# EAGLE design BMS_Slave (EAGLE 7.2.0)

## Sheet 1 of 3
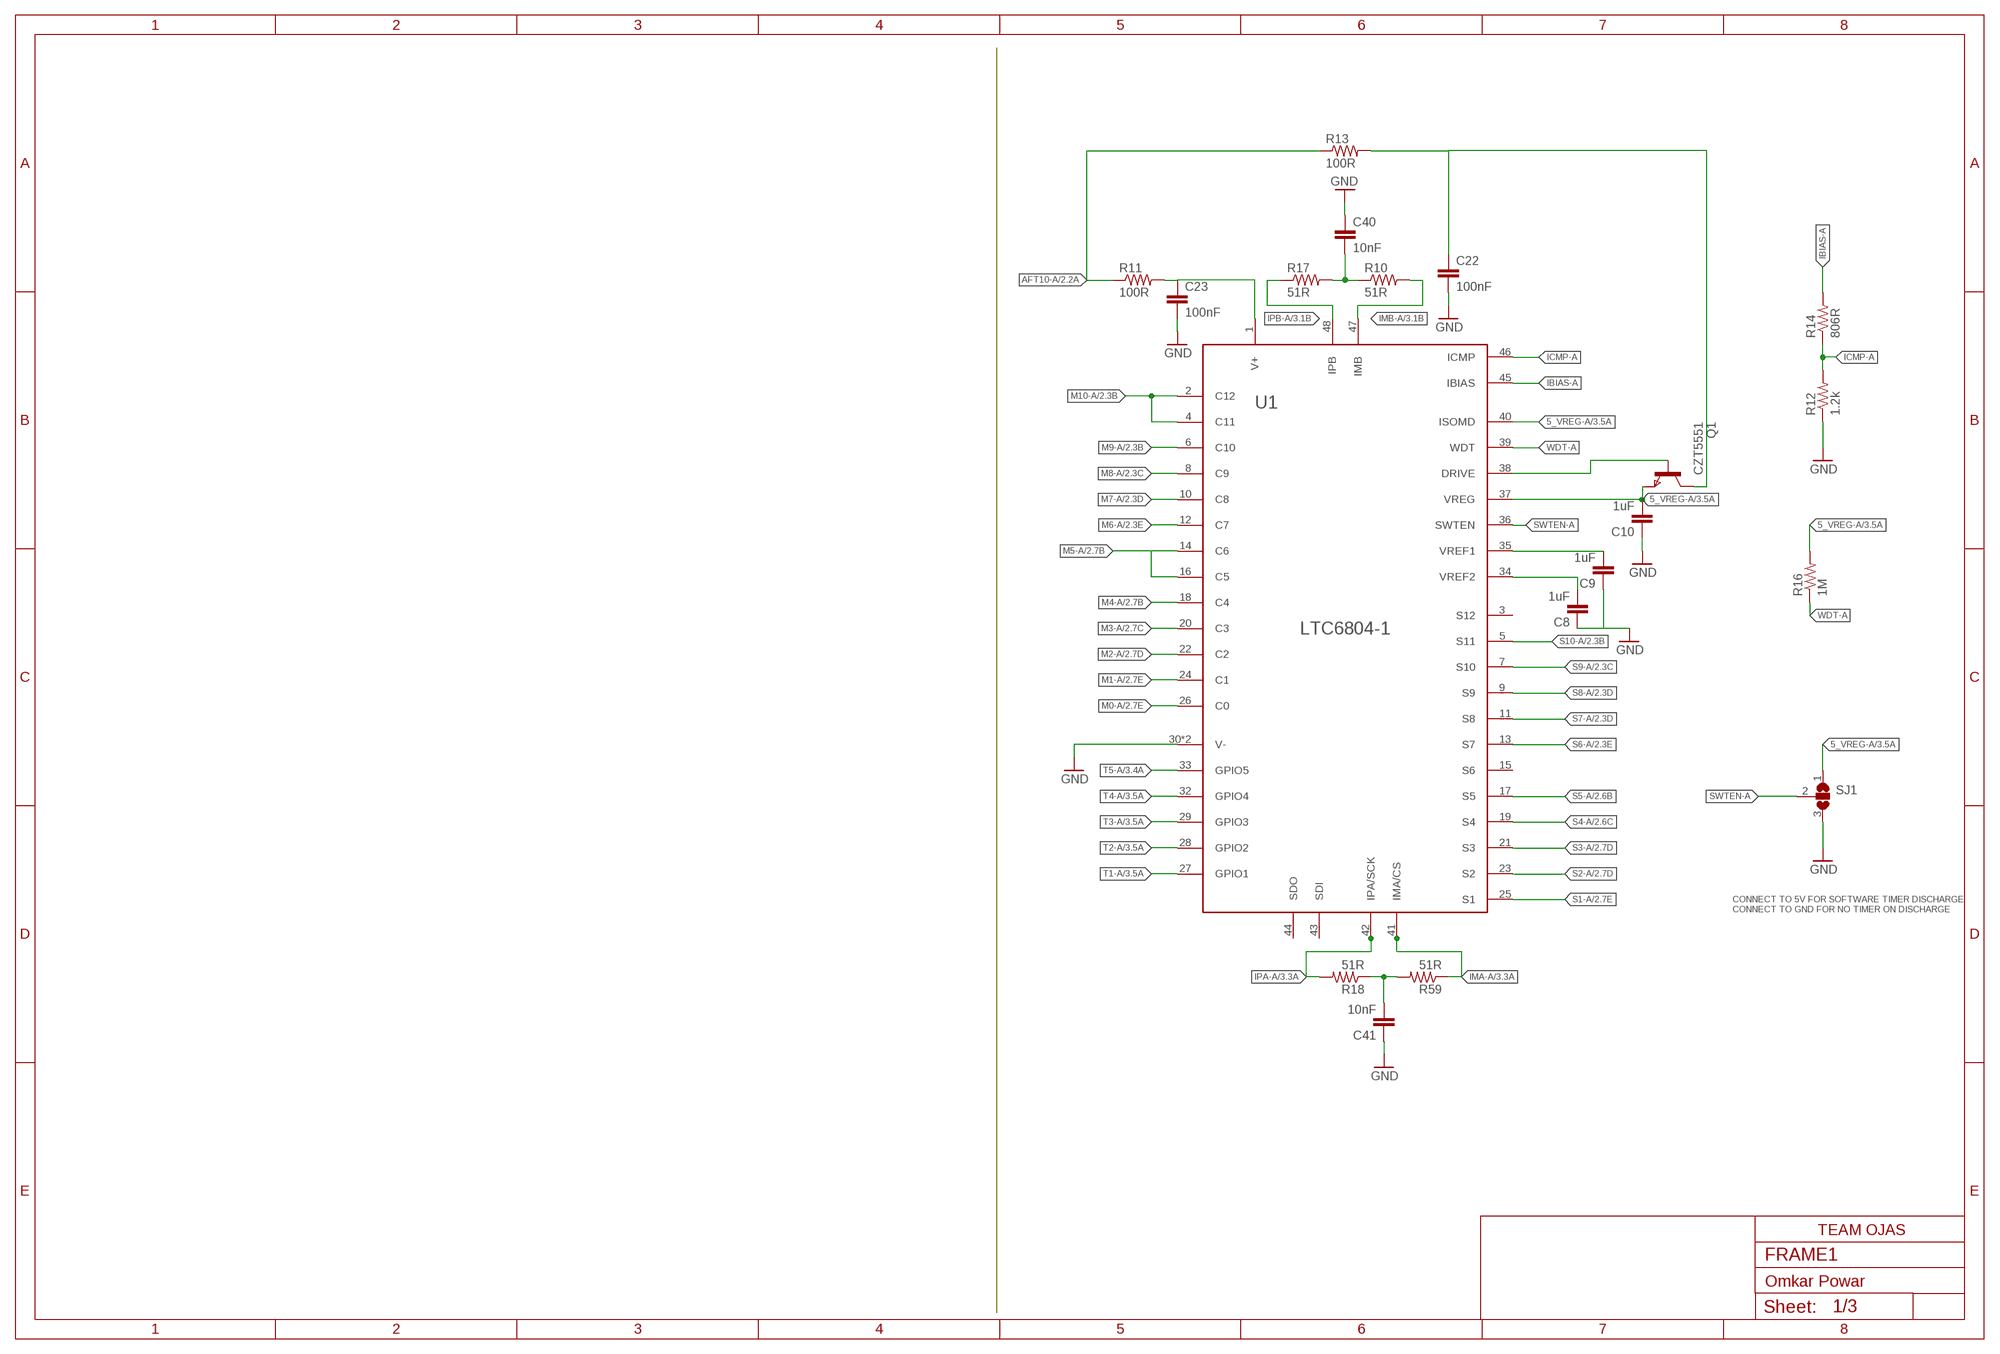
[diagram p0: schematic, sheet 1]

### Parts
C8  1uF  C0603  [0603]
C9  1uF  C0603  [0603]
C10  1uF  C0603  [0603]
C22  100nF  C0805  [0805]
C23  100nF  C0805  [0805]
C40  10nF  C0805  [0805]
C41  10nF  C0805  [0805]
Q1  CZT5551  NSV1C201MZ4  [SOT223]
R10  51R  R0603  [0603]
R11  100R  R0603  [0603]
R12  1.2k  R0603  [0603]
R13  100R  R0603  [0603]
R14  806R  R0603  [0603]
R16  1M  R0603  [0603]
R17  51R  R0603  [0603]
R18  51R  R0603  [0603]
R59  51R  R0603  [0603]
SJ1  SJ2W  [SJ_2]
U1  LTC6804  [48-LEAD_SSOP]

### Nets
5_VREG-A: C10.P$2 Q1.3(E) R16.P$2 SJ1.1 U1.37(VREG) U1.40(ISOMD) ; also sheet 3
AFT10-A: R11.P$1 R13.P$1 ; also sheet 2
GNDA: C8.P$1 C9.P$1 C10.P$1 C22.P$2 C23.P$2 C40.P$1 C41.P$1 R12.P$1 SJ1.3 U1.30(V-) U1.31(V-) ; supply symbol labelled GND ; also sheet 2,3
IBIAS-A: R14.P$2 U1.45(IBIAS)
ICMP-A: R12.P$2 R14.P$1 U1.46(ICMP)
IMA-A: R59.P$1 U1.41(IMA/CS) ; also sheet 3
IMB-A: R10.P$2 U1.47(IMB) ; also sheet 3
IPA-A: R18.P$2 U1.42(IPA/SCK) ; also sheet 3
IPB-A: R17.P$1 U1.48(IPB) ; also sheet 3
M0-A: U1.26(C0) ; also sheet 2
M1-A: U1.24(C1) ; also sheet 2
M2-A: U1.22(C2) ; also sheet 2
M3-A: U1.20(C3) ; also sheet 2
M4-A: U1.18(C4) ; also sheet 2
M5-A: U1.14(C6) U1.16(C5) ; also sheet 2
M6-A: U1.12(C7) ; also sheet 2
M7-A: U1.10(C8) ; also sheet 2
M8-A: U1.8(C9) ; also sheet 2
M9-A: U1.6(C10) ; also sheet 2
M10-A: U1.2(C12) U1.4(C11) ; also sheet 2
N$2: C9.P$2 U1.35(VREF1)
N$3: C8.P$2 U1.34(VREF2)
N$18: C40.P$2 R10.P$1 R17.P$2
N$20: C41.P$2 R18.P$1 R59.P$2
N$36: Q1.1(B) U1.38(DRIVE)
N$49: C22.P$1 Q1.2(C) Q1.4(C) R13.P$2
N$66: C23.P$1 R11.P$2 U1.1(V+)
S1-A: U1.25(S1) ; also sheet 2
S2-A: U1.23(S2) ; also sheet 2
S3-A: U1.21(S3) ; also sheet 2
S4-A: U1.19(S4) ; also sheet 2
S5-A: U1.17(S5) ; also sheet 2
S6-A: U1.13(S7) ; also sheet 2
S7-A: U1.11(S8) ; also sheet 2
S8-A: U1.9(S9) ; also sheet 2
S9-A: U1.7(S10) ; also sheet 2
S10-A: U1.5(S11) ; also sheet 2
SWTEN-A: SJ1.2 U1.36(SWTEN)
T1-A: U1.27(GPIO1) ; also sheet 3
T2-A: U1.28(GPIO2) ; also sheet 3
T3-A: U1.29(GPIO3) ; also sheet 3
T4-A: U1.32(GPIO4) ; also sheet 3
T5-A: U1.33(GPIO5) ; also sheet 3
WDT-A: R16.P$1 U1.39(WDT)
Unconnected: U1.3(S12) U1.15(S6) U1.43(SDI) U1.44(SDO)

### Notes on the sheet
- CONNECT TO 5V FOR SOFTWARE TIMER DISCHARGE
  CONNECT TO GND FOR NO TIMER ON DISCHARGE

## Sheet 2 of 3
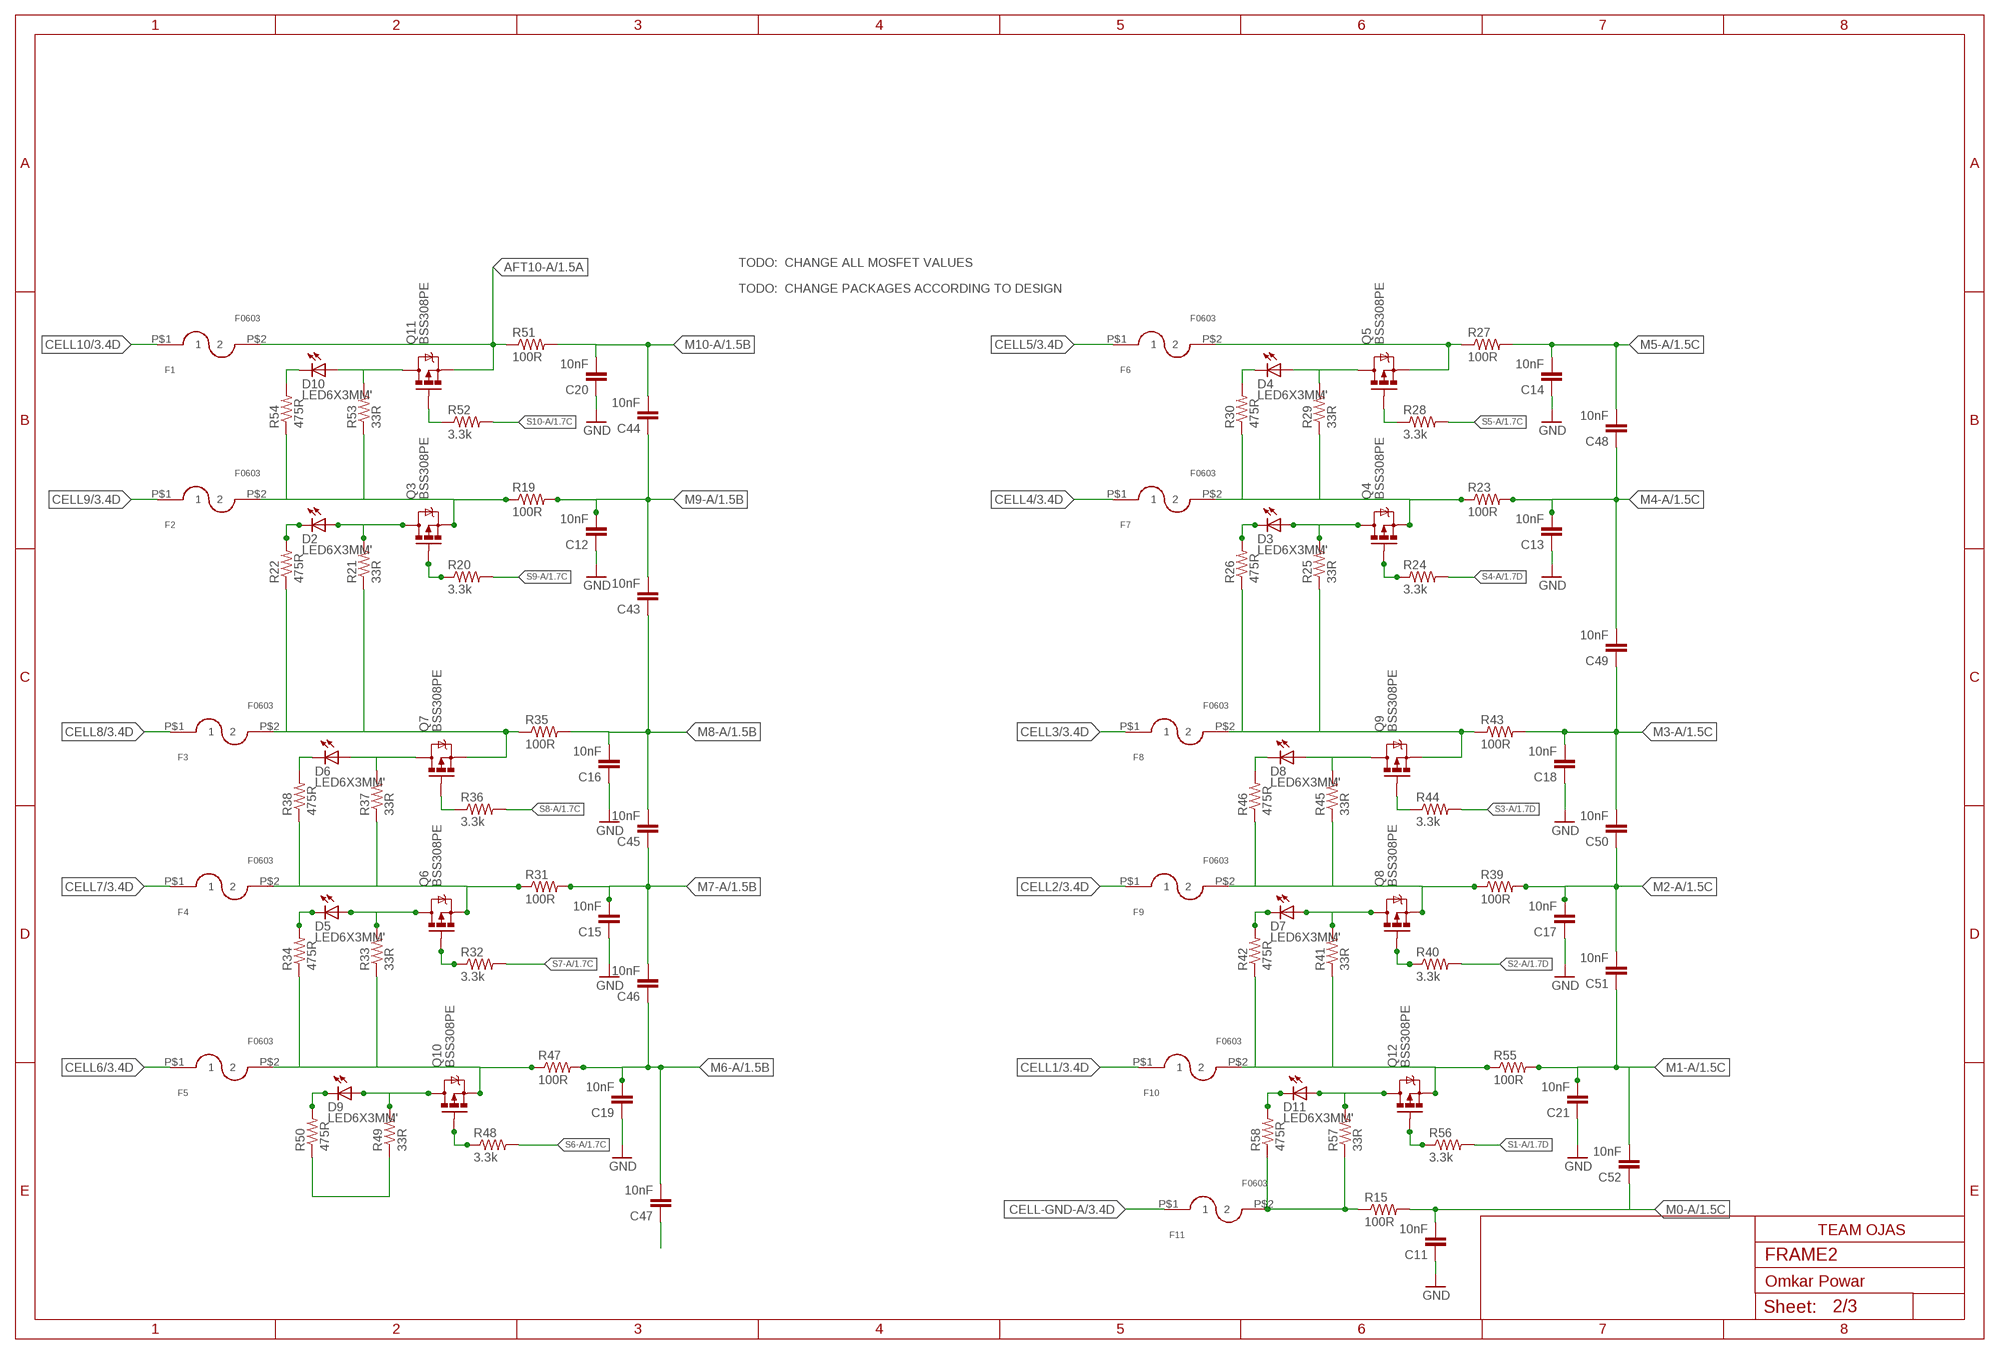
[diagram p1: schematic, sheet 2]

### Parts
C11  10nF  C0603  [0603]
C12  10nF  C0603  [0603]
C13  10nF  C0603  [0603]
C14  10nF  C0603  [0603]
C15  10nF  C0603  [0603]
C16  10nF  C0603  [0603]
C17  10nF  C0603  [0603]
C18  10nF  C0603  [0603]
C19  10nF  C0603  [0603]
C20  10nF  C0603  [0603]
C21  10nF  C0603  [0603]
C43  10nF  C0603  [0603]
C44  10nF  C0603  [0603]
C45  10nF  C0603  [0603]
C46  10nF  C0603  [0603]
C47  10nF  C0603  [0603]
C48  10nF  C0603  [0603]
C49  10nF  C0603  [0603]
C50  10nF  C0603  [0603]
C51  10nF  C0603  [0603]
C52  10nF  C0603  [0603]
D2  LED6X3MM'  [LED0603]
D3  LED6X3MM'  [LED0603]
D4  LED6X3MM'  [LED0603]
D5  LED6X3MM'  [LED0603]
D6  LED6X3MM'  [LED0603]
D7  LED6X3MM'  [LED0603]
D8  LED6X3MM'  [LED0603]
D9  LED6X3MM'  [LED0603]
D10  LED6X3MM'  [LED0603]
D11  LED6X3MM'  [LED0603]
F1  F0603  [0603]
F2  F0603  [0603]
F3  F0603  [0603]
F4  F0603  [0603]
F5  F0603  [0603]
F6  F0603  [0603]
F7  F0603  [0603]
F8  F0603  [0603]
F9  F0603  [0603]
F10  F0603  [0603]
F11  F0603  [0603]
Q3  BSS308PE  MOSFET-P_CHANNEL  [SOT23-3]
Q4  BSS308PE  MOSFET-P_CHANNEL  [SOT23-3]
Q5  BSS308PE  MOSFET-P_CHANNEL  [SOT23-3]
Q6  BSS308PE  MOSFET-P_CHANNEL  [SOT23-3]
Q7  BSS308PE  MOSFET-P_CHANNEL  [SOT23-3]
Q8  BSS308PE  MOSFET-P_CHANNEL  [SOT23-3]
Q9  BSS308PE  MOSFET-P_CHANNEL  [SOT23-3]
Q10  BSS308PE  MOSFET-P_CHANNEL  [SOT23-3]
Q11  BSS308PE  MOSFET-P_CHANNEL  [SOT23-3]
Q12  BSS308PE  MOSFET-P_CHANNEL  [SOT23-3]
R15  100R  R0603  [0603]
R19  100R  R0603  [0603]
R20  3.3k  R0603  [0603]
R21  33R  R2512  [2512]
R22  475R  R0603  [0603]
R23  100R  R0603  [0603]
R24  3.3k  R0603  [0603]
R25  33R  R2512  [2512]
R26  475R  R0603  [0603]
R27  100R  R0603  [0603]
R28  3.3k  R0603  [0603]
R29  33R  R2512  [2512]
R30  475R  R0603  [0603]
R31  100R  R0603  [0603]
R32  3.3k  R0603  [0603]
R33  33R  R2512  [2512]
R34  475R  R0603  [0603]
R35  100R  R0603  [0603]
R36  3.3k  R0603  [0603]
R37  33R  R2512  [2512]
R38  475R  R0603  [0603]
R39  100R  R0603  [0603]
R40  3.3k  R0603  [0603]
R41  33R  R2512  [2512]
R42  475R  R0603  [0603]
R43  100R  R0603  [0603]
R44  3.3k  R0603  [0603]
R45  33R  R2512  [2512]
R46  475R  R0603  [0603]
R47  100R  R0603  [0603]
R48  3.3k  R0603  [0603]
R49  33R  R2512  [2512]
R50  475R  R0603  [0603]
R51  100R  R0603  [0603]
R52  3.3k  R0603  [0603]
R53  33R  R2512  [2512]
R54  475R  R0603  [0603]
R55  100R  R0603  [0603]
R56  3.3k  R0603  [0603]
R57  33R  R2512  [2512]
R58  475R  R0603  [0603]

### Nets
AFT0: F11.P$2 R15.P$1 R57.1 R58.P$1
AFT1: F10.P$2 Q12.2(S) R41.1 R42.P$1 R55.P$1
AFT2: F9.P$2 Q8.2(S) R39.P$1 R45.1 R46.P$1
AFT3: F8.P$2 Q9.2(S) R25.1 R26.P$1 R43.P$1
AFT4: F7.P$2 Q4.2(S) R23.P$1 R29.1 R30.P$1
AFT5: F6.P$2 Q5.2(S) R27.P$1 R49.1 R50.P$1
AFT6: F5.P$2 Q10.2(S) R33.1 R34.P$1 R47.P$1
AFT7: F4.P$2 Q6.2(S) R31.P$1 R37.1 R38.P$1
AFT8: F3.P$2 Q7.2(S) R21.1 R22.P$1 R35.P$1
AFT9: F2.P$2 Q3.2(S) R19.P$1 R53.1 R54.P$1
AFT10-A: F1.P$2 Q11.2(S) R51.P$1 ; also sheet 1
CELL1: F10.P$1 ; also sheet 3
CELL2: F9.P$1 ; also sheet 3
CELL3: F8.P$1 ; also sheet 3
CELL4: F7.P$1 ; also sheet 3
CELL5: F6.P$1 ; also sheet 3
CELL6: F5.P$1 ; also sheet 3
CELL7: F4.P$1 ; also sheet 3
CELL8: F3.P$1 ; also sheet 3
CELL9: F2.P$1 ; also sheet 3
CELL10: F1.P$1 ; also sheet 3
CELL-GND-A: F11.P$1 ; also sheet 3
GNDA: C11.P$1 C12.P$1 C13.P$1 C14.P$1 C15.P$1 C16.P$1 C17.P$1 C18.P$1 C19.P$1 C20.P$1 C21.P$1 ; supply symbol labelled GND ; also sheet 1,3
M0-A: C11.P$2 C52.P$1 R15.P$2 ; also sheet 1
M1-A: C21.P$2 C51.P$1 C52.P$2 R55.P$2 ; also sheet 1
M2-A: C17.P$2 C50.P$1 C51.P$2 R39.P$2 ; also sheet 1
M3-A: C18.P$2 C49.P$1 C50.P$2 R43.P$2 ; also sheet 1
M4-A: C13.P$2 C48.P$1 C49.P$2 R23.P$2 ; also sheet 1
M5-A: C14.P$2 C47.P$1 C48.P$2 R27.P$2 ; also sheet 1
M6-A: C19.P$2 C46.P$1 C47.P$2 R47.P$2 ; also sheet 1
M7-A: C15.P$2 C45.P$1 C46.P$2 R31.P$2 ; also sheet 1
M8-A: C16.P$2 C43.P$1 C45.P$2 R35.P$2 ; also sheet 1
M9-A: C12.P$2 C43.P$2 C44.P$1 R19.P$2 ; also sheet 1
M10-A: C20.P$2 C44.P$2 R51.P$2 ; also sheet 1
N$70: D2.P$1(A) Q3.3(D) R21.2
N$71: D2.P$2(C) R22.P$2
N$72: Q3.1(G) R20.P$1
N$75: D3.P$1(A) Q4.3(D) R25.2
N$76: D3.P$2(C) R26.P$2
N$77: Q4.1(G) R24.P$1
N$80: D4.P$1(A) Q5.3(D) R29.2
N$81: D4.P$2(C) R30.P$2
N$82: Q5.1(G) R28.P$1
N$212: D5.P$1(A) Q6.3(D) R33.2
N$213: D5.P$2(C) R34.P$2
N$214: Q6.1(G) R32.P$1
N$217: D6.P$1(A) Q7.3(D) R37.2
N$218: D6.P$2(C) R38.P$2
N$219: Q7.1(G) R36.P$1
N$223: D7.P$1(A) Q8.3(D) R41.2
N$224: D7.P$2(C) R42.P$2
N$225: Q8.1(G) R40.P$1
N$228: D8.P$1(A) Q9.3(D) R45.2
N$229: D8.P$2(C) R46.P$2
N$230: Q9.1(G) R44.P$1
N$236: D10.P$1(A) Q11.3(D) R53.2
N$237: D10.P$2(C) R54.P$2
N$238: Q11.1(G) R52.P$1
N$239: D9.P$1(A) Q10.3(D) R49.2
N$240: D9.P$2(C) R50.P$2
N$241: Q10.1(G) R48.P$1
N$245: D11.P$1(A) Q12.3(D) R57.2
N$246: D11.P$2(C) R58.P$2
N$247: Q12.1(G) R56.P$1
S1-A: R56.P$2 ; also sheet 1
S2-A: R40.P$2 ; also sheet 1
S3-A: R44.P$2 ; also sheet 1
S4-A: R24.P$2 ; also sheet 1
S5-A: R28.P$2 ; also sheet 1
S6-A: R48.P$2 ; also sheet 1
S7-A: R32.P$2 ; also sheet 1
S8-A: R36.P$2 ; also sheet 1
S9-A: R20.P$2 ; also sheet 1
S10-A: R52.P$2 ; also sheet 1

### Notes on the sheet
- TODO:  CHANGE ALL MOSFET VALUES
- TODO:  CHANGE PACKAGES ACCORDING TO DESIGN

## Sheet 3 of 3
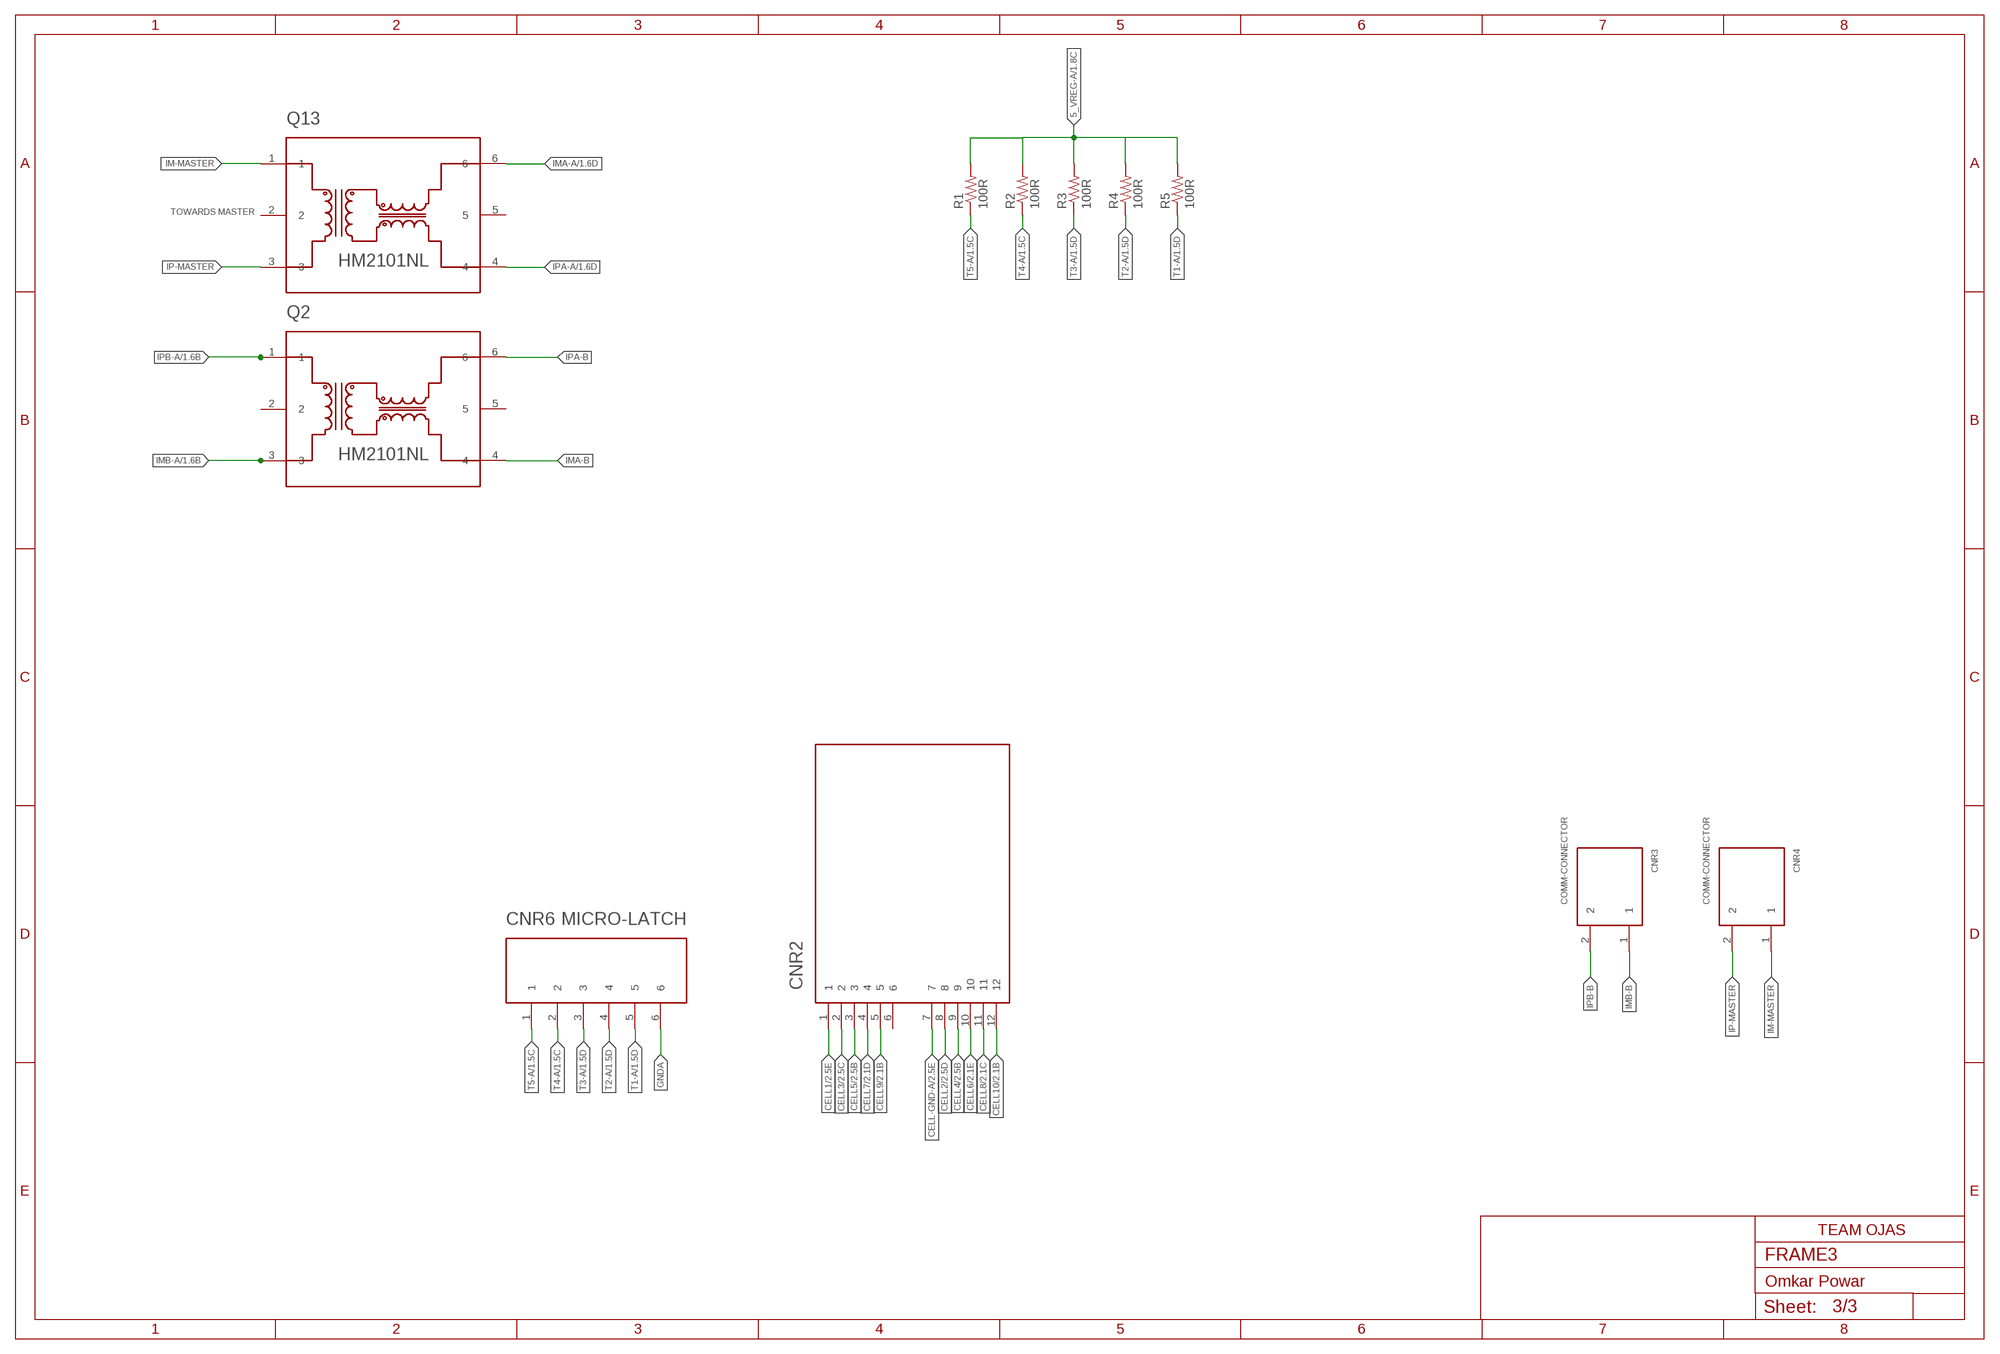
[diagram p2: schematic, sheet 3]

### Parts
CNR2  CELL-CONNECTORMOLEX-MICROFIT  [0430451200]
CNR3  COMM-CONNECTOR  [105313-2202]
CNR4  COMM-CONNECTOR  [105313-2202]
CNR6  MICRO-LATCH  TEMP-6-CONNECTORMICRO-LATCH  [0532530670]
Q2  HM2101NL  [HM2101NL]
Q13  HM2101NL  [HM2101NL]
R1  100R  R0603  [0603]
R2  100R  R0603  [0603]
R3  100R  R0603  [0603]
R4  100R  R0603  [0603]
R5  100R  R0603  [0603]

### Nets
5_VREG-A: R1.P$2 R2.P$2 R3.P$2 R4.P$2 R5.P$2 ; also sheet 1
CELL1: CNR2.1 ; also sheet 2
CELL2: CNR2.8 ; also sheet 2
CELL3: CNR2.2 ; also sheet 2
CELL4: CNR2.9 ; also sheet 2
CELL5: CNR2.3 ; also sheet 2
CELL6: CNR2.10 ; also sheet 2
CELL7: CNR2.4 ; also sheet 2
CELL8: CNR2.11 ; also sheet 2
CELL9: CNR2.5 ; also sheet 2
CELL10: CNR2.12 ; also sheet 2
CELL-GND-A: CNR2.7 ; also sheet 2
GNDA: CNR6.6 ; also sheet 1,2
IM-MASTER: CNR4.1 Q13.1
IMA-A: Q13.6 ; also sheet 1
IMA-B: Q2.4
IMB-A: Q2.3 ; also sheet 1
IMB-B: CNR3.1
IP-MASTER: CNR4.2 Q13.3
IPA-A: Q13.4 ; also sheet 1
IPA-B: Q2.6
IPB-A: Q2.1 ; also sheet 1
IPB-B: CNR3.2
T1-A: CNR6.5 R5.P$1 ; also sheet 1
T2-A: CNR6.4 R4.P$1 ; also sheet 1
T3-A: CNR6.3 R3.P$1 ; also sheet 1
T4-A: CNR6.2 R2.P$1 ; also sheet 1
T5-A: CNR6.1 R1.P$1 ; also sheet 1
Unconnected: CNR2.6 Q2.2 Q2.5 Q13.2 Q13.5

### Notes on the sheet
- TOWARDS MASTER

## Library data of the parts
C8-C23 C40 C41 C43-C52 = Team_Ojas_OVPowar:C
CNR2 = Team_Ojas_OVPowar:CELL-CONNECTOR: BMS Cell Harness Connector, TH/.025 Connector System 1318772-2,
CNR3 CNR4 = Team_Ojas_OVPowar:COMM-CONNECTOR: BMS Communication Harness Connector NanoFit RA Hdr TH DR 12Ckt 0.38um Au Ntl
CNR6 = Team_Ojas_OVPowar:TEMP-6-CONNECTOR
D2-D11 = Team_Ojas_OVPowar:LED
F1-F11 = Team_Ojas_OVPowar:F: FUSE SMD TYPE
Q1 = Team_Ojas_OVPowar:NSV1C201MZ4: NPN TRANSISTOR
Q2 Q13 = Team_Ojas_OVPowar:HM2101NL: Pulse Electronics Signal Transformers MDL SIN XFMR-CMC
Q3-Q12 = Team_Ojas_OVPowar:MOSFET-P_CHANNEL
R1-R5 R10-R59 = Team_Ojas_OVPowar:R
SJ1 = jumper:SJ2W: SMD solder JUMPER
U1 = Team_Ojas_OVPowar:LTC6804: Multicell Battery Monitors

## Board
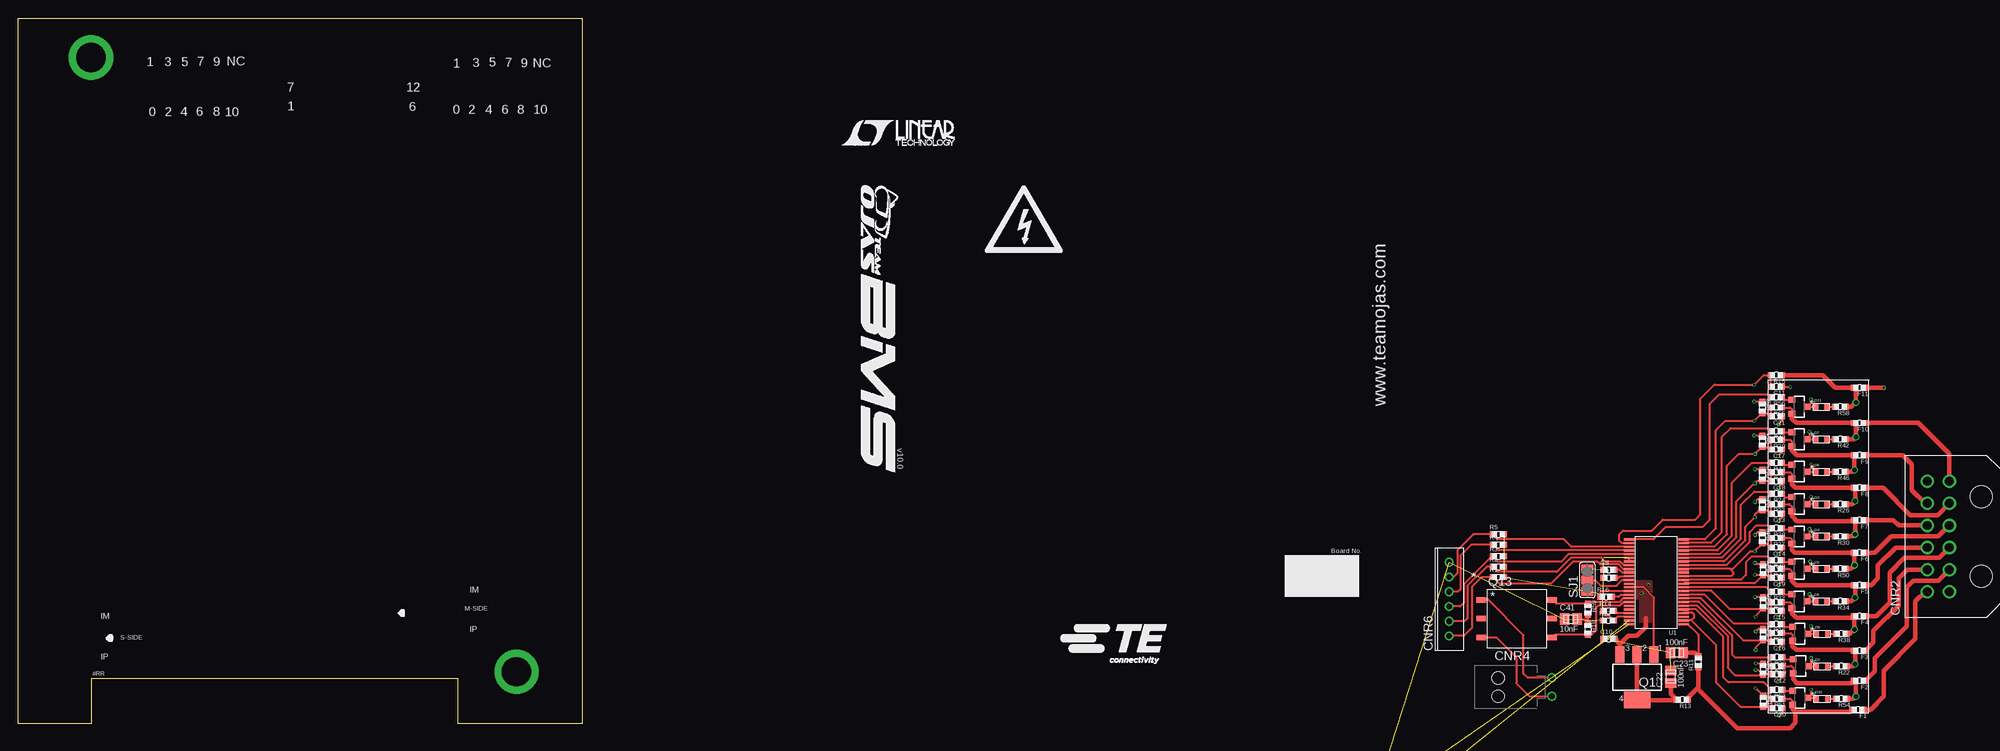
[diagram p3: board, top side]
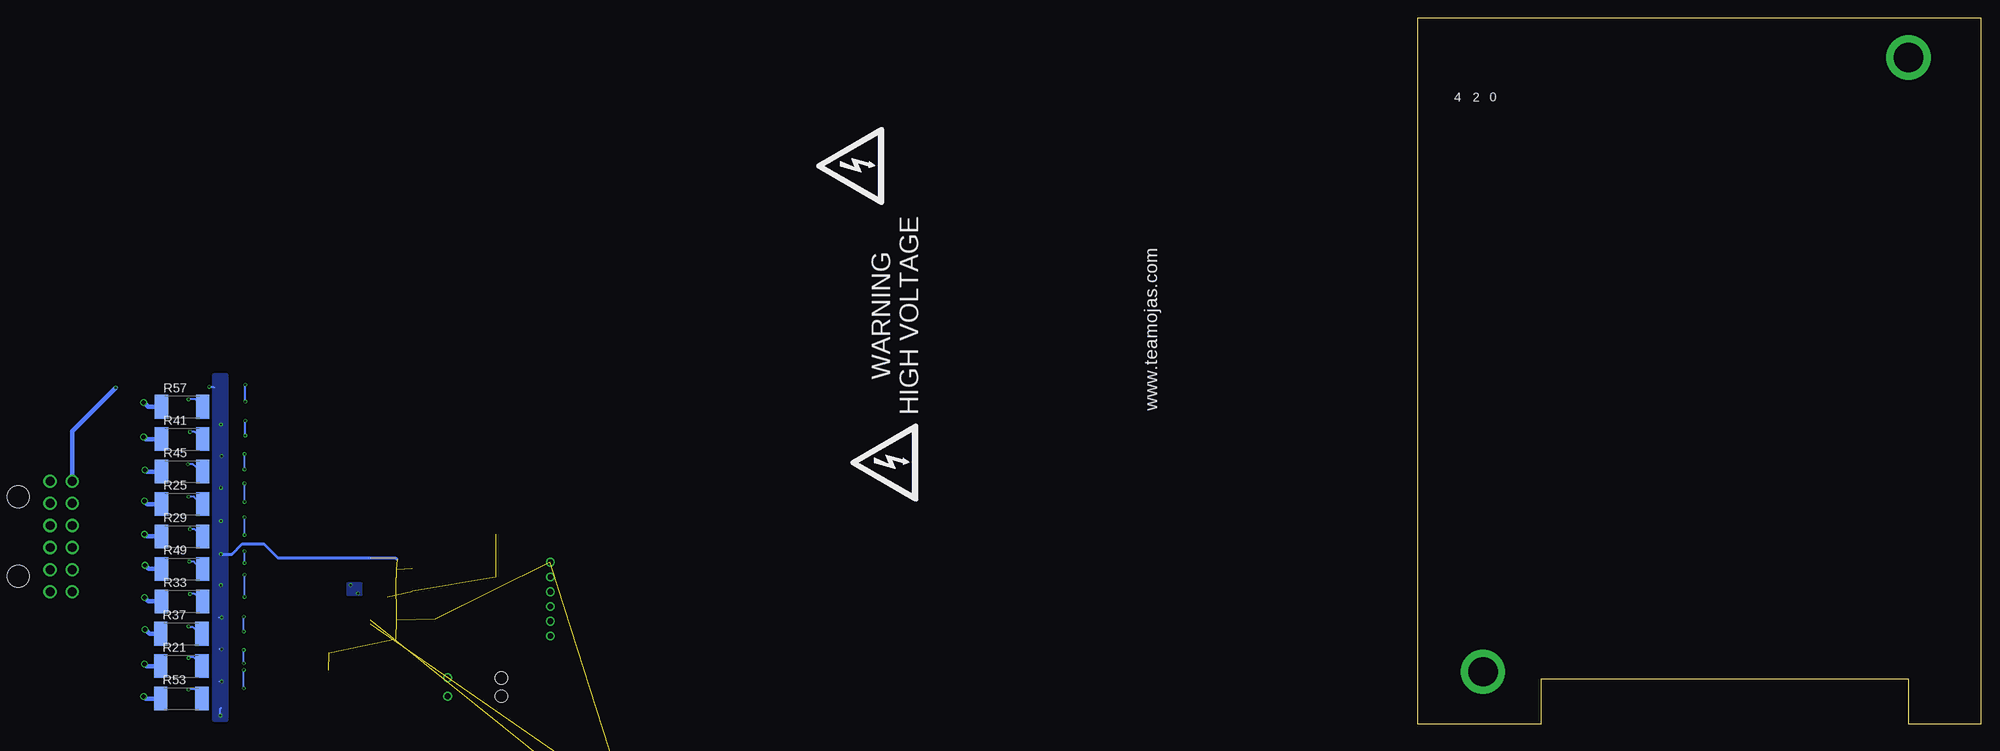
[diagram p4: board, bottom side, seen from below]

Size 76.5 x 95.7 mm. Coordinates in mm from the lower left corner, seen from the top.
Outline: 0,95.7 76.5,95.7 76.5,0 59.7,0 59.7,6.1 9.9,6.1 9.9,0 0,0 0,95.7
Copper layers (1*16): Top 0.035mm / dielectric 1.5mm / Bottom 0.035mm
Design rules "Carnot_syrma": minimum track width 0.1mm, minimum drill 0.2mm, track to track 0.12mm, track to pad 0.12mm, pad to pad 0.12mm, via to via 0.35mm, smd to smd 0.23mm, copper to edge 0.25mm, drill to drill 0.2mm, minimum pad ring 6mil, minimum via ring 4mil, stop-mask expansion 0.05mm, vias tented up to drill 0mil, thermal gap 10mil

### Footprints (pad centres in the part's own frame; a part is rotated, then mirrored left to right if it is on the bottom)
0603 = smd 0.8 x 0.8: P$1 -0.76,0; P$2 0.76,0
0805 = smd 1.3 x 1.5: P$1 -0.85,0; P$2 0.85,0
0430451200 = drill 1.2: 1 7.5,-1.5; 2 4.5,-1.5; 3 1.5,-1.5; 4 -1.5,-1.5; 5 -4.5,-1.5; 6 -7.5,-1.5; 7 7.5,1.5; 8 4.5,1.5; 9 1.5,1.5; 10 -1.5,1.5; 11 -4.5,1.5; 12 -7.5,1.5 | hole 3: -5.4,-5.8; 5.4,-5.8
105313-2202 = drill 0.8 pad 1.2: 1 -1.18,4.98; 2 1.32,4.98 | hole 1.7: -1.18,-2.3; 1.32,-2.3
0532530670 = drill 0.8: 1 -5,0; 2 -3,0; 3 -1,0; 4 1,0; 5 3,0; 6 5,0
LED0603 = smd 0.6 x 0.8: P$1 -0.725,0; P$2 0.725,0
SOT223 = smd 1.219 x 2.235: 1 -2.311,-3.099; 2 0,-3.099; 3 2.311,-3.099 | smd 3.6 x 2.2: 4 0,3.099
HM2101NL = smd 1.3 x 0.76: 1 -4.82,2.54; 2 -4.82,0; 3 -4.82,-2.54; 4 4.82,-2.54; 5 4.82,0; 6 4.82,2.54
SOT23-3 = smd 0.8 x 0.9: 1 -0.95,-1; 2 0.95,-1; 3 0,1.1
2512 = smd 1.8 x 3.2: 1 -2.8,0; 2 2.8,0
SJ_2 = smd 1.168 x 1.6: 1 -1.524,0; 2 0,0; 3 1.524,0
48-LEAD_SSOP = smd 1.4 x 0.3: 1 -3.7,5.8; 2 -3.7,5.3; 3 -3.7,4.8; 4 -3.7,4.3; 5 -3.7,3.8; 6 -3.7,3.3; 7 -3.7,2.8; 8 -3.7,2.3; 9 -3.7,1.8; 10 -3.7,1.3; 11 -3.7,0.8; 12 -3.7,0.3; 13 -3.7,-0.2; 14 -3.7,-0.7; 15 -3.7,-1.2; 16 -3.7,-1.7; 17 -3.7,-2.2; 18 -3.7,-2.7; 19 -3.7,-3.2; 20 -3.7,-3.7; 21 -3.7,-4.2; 22 -3.7,-4.7; 23 -3.7,-5.2; 24 -3.7,-5.7; 25 3.7,-5.7; 26 3.7,-5.2; 27 3.7,-4.7; 28 3.7,-4.2; 29 3.7,-3.7; 30 3.7,-3.2; 31 3.7,-2.7; 32 3.7,-2.2; 33 3.7,-1.7; 34 3.7,-1.2; 35 3.7,-0.7; 36 3.7,-0.2; 37 3.7,0.3; 38 3.7,0.8; 39 3.7,1.3; 40 3.7,1.8; 41 3.7,2.3; 42 3.7,2.8; 43 3.7,3.3; 44 3.7,3.8; 45 3.7,4.3; 46 3.7,4.8; 47 3.7,5.3; 48 3.7,5.8

### Placement (x,y rotation side)
C8  215.9,20.9 0 top  (outside the outline)
C9  215.9,19.8 0 top  (outside the outline)
C10  215.9,11.5 0 top  (outside the outline)
C11  238.63,45.72 180 top  (outside the outline)
C12  238.7,6.7 180 top  (outside the outline)
C13  238.6,28.5 180 top  (outside the outline)
C14  238.6,23.9 180 top  (outside the outline)
C15  238.6,15.3 180 top  (outside the outline)
C16  238.6,11.1 180 top  (outside the outline)
C17  238.6,37.2 180 top  (outside the outline)
C18  238.6,32.9 180 top  (outside the outline)
C19  238.6,19.8 180 top  (outside the outline)
C20  238.68,2.1 180 top  (outside the outline)
C21  238.6,41.7 180 top  (outside the outline)
C22  224.3,6.39 90 top  (outside the outline)
C23  225.1,9.6 180 top  (outside the outline)
C40  184.25,-8.74 90 top  (outside the outline)
C41  210.7,14.2 0 top  (outside the outline)
C43  236.8,7.4 270 top  (outside the outline)
C44  236.84,3.03 270 top  (outside the outline)
C45  236.8,12.1 270 top  (outside the outline)
C46  236.8,16.4 270 top  (outside the outline)
C47  236.8,20.9 270 top  (outside the outline)
C48  236.7,25.2 270 top  (outside the outline)
C49  236.7,29.7 270 top  (outside the outline)
C50  236.7,33.7 270 top  (outside the outline)
C51  236.7,38.3 270 top  (outside the outline)
C52  236.7,42.9 270 top  (outside the outline)
CNR2  260.6,25.4 90 top  (outside the outline)
CNR3  245.69,-12.93 0 top  (outside the outline)
CNR4  203.17,5.03 270 top  (outside the outline)
CNR6  194.2,16.9 90 top  (outside the outline)
D2  244.8,7.8 0 top  (outside the outline)
D3  244.7,29.8 0 top  (outside the outline)
D4  244.7,25.4 0 top  (outside the outline)
D5  244.7,16.6 0 top  (outside the outline)
D6  244.8,12.2 0 top  (outside the outline)
D7  244.7,38.6 0 top  (outside the outline)
D8  244.7,34.2 0 top  (outside the outline)
D9  244.7,21 0 top  (outside the outline)
D10  244.8,3.4 0 top  (outside the outline)
D11  244.7,43 0 top  (outside the outline)
F1  249.7,1.9 180 top  (outside the outline)
F2  249.9,5.8 180 top  (outside the outline)
F3  249.9,9.9 180 top  (outside the outline)
F4  249.9,14.6 180 top  (outside the outline)
F5  249.9,18.8 180 top  (outside the outline)
F6  249.9,23.2 180 top  (outside the outline)
F7  249.9,27.6 180 top  (outside the outline)
F8  249.9,32 180 top  (outside the outline)
F9  249.9,36.4 180 top  (outside the outline)
F10  249.9,40.8 180 top  (outside the outline)
F11  249.9,45.6 180 top  (outside the outline)
Q1  219.7,6.3 180 top  (outside the outline)
Q2  174.8,-37.62 180 top  (outside the outline)
Q3  241.9,7.8 270 top  (outside the outline)
Q4  241.7,29.8 270 top  (outside the outline)
Q5  241.7,25.4 270 top  (outside the outline)
Q6  241.7,16.6 270 top  (outside the outline)
Q7  241.8,12.2 270 top  (outside the outline)
Q8  241.7,38.6 270 top  (outside the outline)
Q9  241.7,34.2 270 top  (outside the outline)
Q10  241.7,21 270 top  (outside the outline)
Q11  241.8,3.5 270 top  (outside the outline)
Q12  241.7,43 270 top  (outside the outline)
Q13  203.37,14.25 0 top  (outside the outline)
R1  200.9,19.9 0 top  (outside the outline)
R2  200.9,21.3 0 top  (outside the outline)
R3  200.9,22.7 0 top  (outside the outline)
R4  200.9,24.3 0 top  (outside the outline)
R5  200.9,25.7 0 top  (outside the outline)
R10  185.7,-11.8 0 top  (outside the outline)
R11  228,8.4 90 top  (outside the outline)
R12  215.8,14 0 top  (outside the outline)
R13  225.85,3.25 180 top  (outside the outline)
R14  215.8,15.3 0 top  (outside the outline)
R15  238.6,47.3 180 top  (outside the outline)
R16  215.5,17.2 0 top  (outside the outline)
R17  182.8,-11.8 0 top  (outside the outline)
R18  213,12.8 270 top  (outside the outline)
R19  238.7,7.8 180 top  (outside the outline)
R20  238.7,9 180 top  (outside the outline)
R21  244.3,7.8 0 bottom  (outside the outline)
R22  247.4,7.8 180 top  (outside the outline)
R23  238.6,29.8 180 top  (outside the outline)
R24  238.6,31.2 180 top  (outside the outline)
R25  244.2,29.8 0 bottom  (outside the outline)
R26  247.3,29.8 180 top  (outside the outline)
R27  238.6,25.2 180 top  (outside the outline)
R28  238.6,26.5 180 top  (outside the outline)
R29  244.2,25.4 0 bottom  (outside the outline)
R30  247.3,25.4 180 top  (outside the outline)
R31  238.6,16.5 180 top  (outside the outline)
R32  238.6,17.9 180 top  (outside the outline)
R33  244.2,16.6 0 bottom  (outside the outline)
R34  247.3,16.6 180 top  (outside the outline)
R35  238.6,12.3 180 top  (outside the outline)
R36  238.6,13.5 180 top  (outside the outline)
R37  244.3,12.2 0 bottom  (outside the outline)
R38  247.4,12.2 180 top  (outside the outline)
R39  238.6,38.5 180 top  (outside the outline)
R40  238.6,39.7 180 top  (outside the outline)
R41  244.2,38.6 0 bottom  (outside the outline)
R42  247.3,38.6 180 top  (outside the outline)
R43  238.6,34.1 180 top  (outside the outline)
R44  238.6,35.4 180 top  (outside the outline)
R45  244.2,34.2 0 bottom  (outside the outline)
R46  247.3,34.2 180 top  (outside the outline)
R47  238.6,21 180 top  (outside the outline)
R48  238.6,22.2 180 top  (outside the outline)
R49  244.2,21 0 bottom  (outside the outline)
R50  247.3,21 180 top  (outside the outline)
R51  238.7,3.4 180 top  (outside the outline)
R52  238.66,4.59 180 top  (outside the outline)
R53  244.3,3.4 0 bottom  (outside the outline)
R54  247.4,3.4 180 top  (outside the outline)
R55  238.6,42.9 180 top  (outside the outline)
R56  238.6,44.3 180 top  (outside the outline)
R57  244.2,43 0 bottom  (outside the outline)
R58  247.3,43 180 top  (outside the outline)
R59  213,15.5 270 top  (outside the outline)
SJ1  212.98,19.49 90 top  (outside the outline)
U1  222.3,19.3 180 top  (outside the outline)

### Tracks (layer width: path | path; a pad name or v marks a point on that pad's centre or on a via)
5_VREG-A  (via drill 0.25)  (6 unrouted)
  Top 0.254: 218.63,17.5 U1.40 218.58,17.52 217.52,17.52 217.2,17.2 R16.P$2
  Top 0.61: Q1.3 217.39,10.77 | 217.39,10.77 C10.P$2 | 220.9,14.3 220.9,13.1 219.7,11.9 218.52,11.9 217.39,10.77
  other vias: 220.3,17.7 221.3,18.8
  pour Top: 218.8,19.3 218.8,17 220.1,17 220.1,13.8 221.7,13.8 221.7,19.3
  pour Bottom: 219.9,19.1 219.9,17.4 221.7,17.4 221.7,19.1
AFT0  (via drill 0.6)
  Top 0.61: R58.P$1 248.8,43 v249.4,43.6 249.4,45.34 F11.P$2 246.6,45.6 244.9,47.3 R15.P$1
  Bottom 0.61: R57.1 248.8,43 v249.4,43.6
AFT1  (via drill 0.6)
  Top 0.254: R55.P$1 240.5,42.9 240.7,42.7 Q12.2
  Top 0.61: Q12.2 240.7,41.4 241.3,40.8 F10.P$2 249.4,40.54 v249.4,38.9 249.1,38.6 R42.P$1
  Bottom 0.61: R41.1 249.1,38.6 v249.4,38.9
AFT2  (via drill 0.6)
  Top 0.254: R39.P$1 240.5,38.5 240.7,38.3 Q8.2
  Top 0.61: Q8.2 240.7,37.1 241.4,36.4 F9.P$2 249.2,36.34 v249.2,34.4 249,34.2 R46.P$1
  Bottom 0.61: R45.1 249,34.2 v249.2,34.4
AFT3  (via drill 0.6)
  Top 0.254: R43.P$1 240.5,34.1 240.7,33.9 Q9.2
  Top 0.61: Q9.2 240.7,32.5 241.2,32 F8.P$2 249.3,31.84 v249.3,30.2 248.9,29.8 R26.P$1
  Bottom 0.61: R25.1 248.9,29.8 v249.3,30.2
AFT4  (via drill 0.6)
  Top 0.254: R23.P$1 240.4,29.8 240.7,29.5 Q4.2
  Top 0.61: Q4.2 240.7,28.2 241.4,27.5 249.04,27.5 F7.P$2 249.3,27.44 v249.3,25.7 249,25.4 R30.P$1
  Bottom 0.61: R29.1 249,25.4 v249.3,25.7
AFT5  (via drill 0.6)
  Top 0.254: R27.P$1 240.5,25.2 240.7,25 Q5.2
  Top 0.61: Q5.2 240.7,23.6 241.1,23.2 F6.P$2 249.1,23.16 249.2,23.06 v249.2,21.5 248.7,21 R50.P$1
  Bottom 0.61: R49.1 248.7,21 v249.2,21.5
AFT6  (via drill 0.6)
  Top 0.254: R47.P$1 240.4,21 240.7,20.7 Q10.2
  Top 0.61: Q10.2 240.7,19.4 241.3,18.8 F5.P$2 249.3,18.64 v249.3,17.1 248.8,16.6 R34.P$1
  Bottom 0.61: R33.1 248.8,16.6 v249.3,17.1
AFT7  (via drill 0.6)
  Top 0.254: R31.P$1 240.5,16.5 240.7,16.3 Q6.2
  Top 0.61: Q6.2 240.7,15 241.3,14.4 248.94,14.4 F4.P$2 249.2,14.54 v249.2,12.8 248.6,12.2 R38.P$1
  Bottom 0.61: R37.1 248.6,12.2 v249.2,12.8
AFT8  (via drill 0.6)
  Top 0.254: R35.P$1 240.6,12.3 240.8,12.1 Q7.2
  Top 0.61: Q7.2 240.8,10.5 241.3,10 249.04,10 F3.P$2 249.3,9.74 v249.3,8.1 249,7.8 R22.P$1
  Bottom 0.61: R21.1 249,7.8 v249.3,8.1
AFT9  (via drill 0.6)
  Top 0.254: R19.P$1 240.7,7.8 240.9,7.6 Q3.2
  Top 0.61: Q3.2 240.9,6 241.4,5.5 248.84,5.5 F2.P$2 249.4,5.54 v249.4,3.7 249.1,3.4 R54.P$1
  Bottom 0.61: R53.1 249.1,3.4 v249.4,3.7
AFT10-A
  Top 0.254: R51.P$1 240.5,3.4 240.8,3.1 Q11.2
  Top 0.61: Q11.2 240.8,2 241.2,1.6 | 241.2,1.6 248.64,1.6 F1.P$2 | R11.P$1 228,4.8 | 228,4.8 228,4.7 233.3,-0.6 240.5,-0.6 241.2,0.1 241.2,1.6 | 228,4.8 227.95,4.85 226.61,3.51 R13.P$1
CELL1
  Top 0.61: CNR2.1 262.1,36.6 257.9,40.8 F10.P$1
CELL2
  Top 0.61: CNR2.8 258.8,29.9 257,31.7 257,35.2 255.8,36.4 F9.P$1
CELL3
  Top 0.61: CNR2.2 260.5,28.3 256.8,28.3 253.1,32 F8.P$1
CELL4
  Top 0.61: CNR2.9 255.2,26.9 254.5,27.6 F7.P$1
CELL5
  Top 0.61: CNR2.3 260.6,25.4 254.2,25.4 252,23.2 F6.P$1
CELL6
  Top 0.61: CNR2.10 254.8,23.9 252.4,21.5 252.4,19.7 251.5,18.8 F5.P$1
CELL7
  Top 0.61: CNR2.4 260.7,22.5 256,22.5 254,20.5 254,16.4 252.2,14.6 F4.P$1
CELL8
  Top 0.61: CNR2.11 256.4,20.9 255.2,19.7 255.2,16 251.8,12.6 251.8,11.04 F3.P$1
CELL9
  Top 0.61: CNR2.5 260.6,19.4 257.2,19.4 256.3,18.5 256.3,13.2 252,8.9 252,7.14 F2.P$1
CELL10
  Top 0.61: CNR2.12 258.8,17.9 257.5,16.6 257.5,11.5 253.2,7.2 253.2,3.7 251.4,1.9 F1.P$1
CELL-GND-A  (via drill 0.25)
  Top 0.61: v253.2,45.6 F11.P$1
  Bottom 0.61: CNR2.7 259.1,39.7 v253.2,45.6
GNDA  (via drill 0.25)  (11 unrouted)
  Top 0.254: C21.P$1 239.36,41.06 v238.9,40.6 | C17.P$1 239.36,36.86 v238.8,36.3 | C18.P$1 239.36,32.46 v238.9,32 | C13.P$1 239.36,27.96 v238.9,27.5 | C14.P$1 239.36,23.46 v238.9,23 | C19.P$1 239.36,19.26 v238.9,18.8 | C15.P$1 239.36,14.96 v238.8,14.4 | C16.P$1 239.36,10.66 v238.8,10.1 | C12.P$1 239.46,6.36 v238.8,5.7 | C20.P$1 239.44,1.55 v239,1.1 | U1.30 U1.31 | C11.P$1 240.48,45.72 v240.5,45.7
  Bottom 0.254: v238.9,40.6 238.8,40.6 | v238.8,36.3 238.9,36.3 | v238.9,32 239,32.1 | v238.9,27.5 239.1,27.5 | v238.9,23 239.1,23 | v238.9,18.8 239.1,18.8 | v238.8,14.4 239.2,14.4 | v238.8,10.1 239.1,10.1 | v238.8,5.7 239.1,5.7 | v239,1.1 239,2 238.9,2.1 | v240.5,45.7 239.9,45.7 239.8,45.6
  Bottom 0.406: v238.9,23 237.4,23 236,24.4 233.1,24.4 231.2,22.5 215.2,22.5 215,22.3
  pour Bottom: 238.2,47.3 238.2,0.5 239.8,0.5 239.8,47.3
IBIAS-A
  Top 0.254: U1.45 216.86,15 R14.P$2
ICMP-A
  Top 0.254: R14.P$1 215.04,15.06 215.4,14.7 215.86,14.7 R12.P$2 217.06,14.5 U1.46
IM-MASTER
  Top 0.254: CNR4.1 204.89,6.21 204.3,6.8 204.3,12 199.5,16.8 Q13.1
IMA-A
  Top 0.254: U1.41 217.8,17 217.3,16.5 213.24,16.5 R59.P$1 208.72,16.26 Q13.6
IMB-A  (2 unrouted)
IP-MASTER
  Top 0.254: Q13.3 200.59,11.71 203.3,9 203.3,5.5 205.1,3.7 208.13,3.7 CNR4.2
IPA-A
  Top 0.254: U1.42 217.9,16.5 217.4,16 214.4,16 214.1,15.7 214.1,12.6 213.6,12.1 213.06,12.1 R18.P$2 208.52,12.04 Q13.4
IPB-A  (2 unrouted)
M0-A  (via drill 0.25)
  Top 0.254: C52.P$1 236.66,43.7 v235.6,43.7 | C11.P$2 237.87,47.27 R15.P$2 236.9,47.3 v235.6,46 230.2,46 228.3,44.1 228.3,28.4 227.6,27.7 223.2,27.7 221.7,26.2 217.8,26.2 217.3,25.7 217.3,24.8 217.58,24.52 218.58,24.52 U1.26
  Bottom 0.254: v235.6,43.7 v235.6,46
M1-A  (via drill 0.25)
  Top 0.254: R55.P$2 C21.P$2 237.4,42.14 C52.P$2 | 236.64,42.2 C52.P$2 | C51.P$1 236.66,39.1 v235.6,39.1 | C52.P$2 236.64,42.14 v235.6,41.1 231.7,41.1 230.4,39.8 230.4,26.5 228.92,25.02 226.02,25.02 U1.24
  Bottom 0.254: v235.6,39.1 v235.6,41.1
M2-A  (via drill 0.25)
  Top 0.254: R39.P$2 C17.P$2 237.5,37.54 C51.P$2 | 236.66,37.5 C51.P$2 | C50.P$1 236.66,34.5 v235.7,34.5 | C51.P$2 236.64,37.54 v235.7,36.6 233.5,36.6 231.9,35 231.9,25.7 230.22,24.02 226.02,24.02 U1.22
  Bottom 0.254: v235.7,34.5 v235.7,36.6
M3-A  (via drill 0.25)
  Top 0.254: R43.P$2 C18.P$2 237.8,32.94 C50.P$2 | 236.66,32.9 C50.P$2 | C49.P$1 236.06,30.46 v235.7,30.1 | C50.P$2 236.04,32.94 v235.7,32.6 235.6,32.6 233.2,30.2 233.2,25.3 230.92,23.02 226.02,23.02 U1.20
  Bottom 0.254: v235.7,30.1 v235.7,32.6
M4-A  (via drill 0.25)
  Top 0.254: R23.P$2 C13.P$2 237.4,28.94 C49.P$2 236.66,28.9 236.2,28.9 235.7,28.4 v235.7,28 234.4,26.7 234.4,24.9 231.52,22.02 226.02,22.02 U1.18 | C48.P$1 236.06,25.96 v235.7,25.6
  Bottom 0.254: v235.7,25.6 v235.7,28
M5-A  (via drill 0.25)
  Top 0.254: R27.P$2 C14.P$2 237.3,24.44 C48.P$2 | 226.03,21 U1.16 226.02,21.02 232.32,21.02 | 236.66,24.4 C48.P$2 | 232.32,21.02 232.8,20.54 232.8,20.3 232.52,20.02 226.02,20.02 U1.14 | C47.P$1 235.84,21.66 v235.7,21.8 | C48.P$2 235.7,23.44 v235.7,23.4 235.1,23.4 232.72,21.02 232.32,21.02
  Bottom 0.254: v235.7,21.8 v235.7,23.4
M6-A  (via drill 0.25)
  Top 0.254: R47.P$2 C19.P$2 237.5,20.14 C47.P$2 | C47.P$2 235.68,19.02 226.02,19.02 U1.12 | C46.P$1 235.74,17.16 v235.7,17.2 | v235.7,20.2 236.74,20.2 C47.P$2
  Bottom 0.254: v235.7,17.2 v235.7,20.2
M7-A  (via drill 0.25)
  Top 0.254: R31.P$2 C15.P$2 237.5,15.64 C46.P$2 | C46.P$2 236.76,15.6 232.2,15.6 229.78,18.02 226.02,18.02 U1.10 | C45.P$1 236.16,12.86 v235.8,12.5 | v235.8,14.5 235.8,14.64 C46.P$2
  Bottom 0.254: v235.8,12.5 v235.8,14.5
M8-A  (via drill 0.25)
  Top 0.254: R35.P$2 C16.P$2 237.6,11.34 C45.P$2 | C45.P$2 236.76,11.3 234.1,11.3 228.38,17.02 226.02,17.02 U1.8 | v235.8,10 235.8,10.34 C45.P$2 | C43.P$1 235.84,8.16 v235.8,8.2
  Bottom 0.254: v235.8,8.2 v235.8,10
M9-A  (via drill 0.25)
  Top 0.254: R19.P$2 C12.P$2 236.86,6.7 C43.P$2 | C43.P$2 236.76,6.6 233,6.6 232,7.6 232,11.9 227.88,16.02 226.02,16.02 U1.6 | v235.8,7.3 236.14,7.3 C43.P$2 | C44.P$1 236.81,3.79 v235.8,4.8
  Bottom 0.254: v235.8,4.8 v235.8,7.3
M10-A
  Top 0.254: R51.P$2 237.94,2.12 C20.P$2 237.75,2.27 C44.P$2 236.81,2.3 233.7,2.3 230.4,5.6 230.4,10.7 227.1,14 | 226.02,14.02 U1.2 226.7,14 227.1,14 | U1.4 226.02,15.02 227.18,15.02 227.4,14.8 227.4,14.3 227.1,14
N$2
  Top 0.254: C9.P$2 217.2,19.8 217.4,20 U1.35
N$3
  Top 0.254: U1.34 217.7,20.5 217.3,20.9 C8.P$2
N$6  (via drill 4 pad 6)
  other vias: 9.86,90.41
N$13  (via drill 4 pad 6)
  other vias: 67.61,7.04
N$18  (2 unrouted)
N$20
  Top 0.254: R59.P$2 213,14.1 | 213,14.1 R18.P$1 | C41.P$2 212.9,14.2 213,14.1
N$36
  Top 0.254: Q1.1 222.01,17.09 220.6,18.5 U1.38
N$49
  Top 0.61: Q1.2 Q1.4 225.04,3.2 R13.P$2 224.3,4.04 C22.P$1
N$66
  Top 0.254: U1.1 226.02,13.52 226.58,13.52 228,12.1 R11.P$2
  Top 0.61: C23.P$1 227.56,9.6 R11.P$2
N$70  (via drill 0.25)
  Top 0.254: D2.P$1 Q3.3 243.3,8.1 v243.3,8.9
  Bottom 0.254: R21.2 241.4,7.8 242.6,9 243.2,9 v243.3,8.9
N$71
  Top 0.254: D2.P$2 R22.P$2
N$72
  Top 0.254: R20.P$1 239.71,8.75 Q3.1
N$75  (via drill 0.25)
  Top 0.254: D3.P$1 Q4.3 243.3,30.3 v243.3,30.8
  Bottom 0.254: R25.2 241.6,29.8 242.6,30.8 v243.3,30.8
N$76
  Top 0.254: D3.P$2 R26.P$2
N$77
  Top 0.254: R24.P$1 239.81,30.75 Q4.1
N$80  (via drill 0.25)
  Top 0.254: D4.P$1 Q5.3 243.1,25.7 v243.1,26.4
  Bottom 0.254: R29.2 241.5,25.4 242.5,26.4 v243.1,26.4
N$81
  Top 0.254: D4.P$2 R30.P$2
N$82
  Top 0.254: R28.P$1 239.51,26.35 Q5.1
N$212  (via drill 0.25)
  Top 0.254: D5.P$1 Q6.3 243.1,16.9 v243.1,17.6
  Bottom 0.254: R33.2 241.5,16.6 242.5,17.6 v243.1,17.6
N$213
  Top 0.254: D5.P$2 R34.P$2
N$214
  Top 0.254: R32.P$1 239.71,17.55 Q6.1
N$217  (via drill 0.25)
  Top 0.254: D6.P$1 Q7.3 243.3,12.6 v243.3,13.2
  Bottom 0.254: R37.2 241.8,12.2 242.7,13.1 243.2,13.1 v243.3,13.2
N$218
  Top 0.254: D6.P$2 R38.P$2
N$219
  Top 0.254: R36.P$1 239.71,13.15 Q7.1
N$223  (via drill 0.25)
  Top 0.254: D7.P$1 Q8.3 243.1,38.9 v243.1,39.6
  Bottom 0.254: R41.2 241.5,38.6 242.5,39.6 v243.1,39.6
N$224
  Top 0.254: D7.P$2 R42.P$2
N$225
  Top 0.254: R40.P$1 239.51,39.55 Q8.1
N$228  (via drill 0.25)
  Top 0.254: D8.P$1 Q9.3 243.4,34.8 v243.4,35.2
  Bottom 0.254: R45.2 241.7,34.2 242.7,35.2 v243.4,35.2
N$229
  Top 0.254: D8.P$2 R46.P$2
N$230
  Top 0.254: R44.P$1 239.61,35.15 Q9.1
N$236  (via drill 0.25)
  Top 0.254: D10.P$1 243.97,3.5 Q11.3 243.3,3.9 v243.3,4.6
  Bottom 0.254: v243.3,4.6 243.2,4.7 242.5,4.7 241.5,3.7 R53.2
N$237
  Top 0.254: D10.P$2 R54.P$2
N$238
  Top 0.254: R52.P$1 239.56,4.45 Q11.1
N$239  (via drill 0.25)
  Top 0.254: D9.P$1 Q10.3 243.2,21.4 v243.2,22
  Bottom 0.254: R49.2 241.6,21 242.6,22 v243.2,22
N$240
  Top 0.254: D9.P$2 R50.P$2
N$241
  Top 0.254: Q10.1 239.61,21.95 R48.P$1
N$245  (via drill 0.25)
  Top 0.254: D11.P$1 Q12.3 243.3,43.5 v243.3,44
  Bottom 0.254: R57.2 242.4,44 v243.3,44
N$246
  Top 0.254: D11.P$2 R58.P$2
N$247
  Top 0.254: R56.P$1 239.71,43.95 Q12.1
S1-A
  Top 0.254: R56.P$2 237.44,44.7 230.9,44.7 229.6,43.4 229.6,27.7 228.6,26.7 223.6,26.7 221.92,25.02 218.62,25.02 U1.25
S2-A
  Top 0.254: R40.P$2 237.44,40.1 232.4,40.1 231.2,38.9 231.2,26 229.72,24.52 226.02,24.52 U1.23
S3-A
  Top 0.254: R44.P$2 235.3,35.4 232.6,32.7 232.6,25.5 230.62,23.52 226.02,23.52 U1.21
S4-A
  Top 0.254: R24.P$2 237.54,31.5 235.6,31.5 233.8,29.7 233.8,25.1 231.22,22.52 226.02,22.52 U1.19
S5-A
  Top 0.254: R28.P$2 237.44,26.9 235.9,26.9 235,26 235,24.7 231.82,21.52 226.02,21.52 U1.17
S6-A
  Top 0.254: R48.P$2 237.84,22.3 237.44,22.7 235.3,22.7 234.5,21.9 234.5,20.2 233.82,19.52 226.02,19.52 U1.13
S7-A
  Top 0.254: R32.P$2 237.22,18.52 226.02,18.52 U1.11
S8-A
  Top 0.254: R36.P$2 237.74,13.6 232.8,13.6 228.88,17.52 226.02,17.52 U1.9
S9-A
  Top 0.254: R20.P$2 233,9 232.6,9.4 232.6,12 228.08,16.52 226.02,16.52 U1.7
S10-A
  Top 0.254: R52.P$2 236.9,5.6 232.1,5.6 231.4,6.3 231.4,11.8 227.7,15.5 U1.5
SWTEN-A
  Top 0.254: SJ1.2 214.01,19.48 214.8,18.7 216.9,18.7 217.7,19.5 U1.36
T1-A
  Top 0.254: U1.27 210.8,24 209.8,25 200.74,25 200.14,25.6 R5.P$1 197.5,25.7 195.3,23.5 195.3,20.4 194.8,19.9 CNR6.5
T2-A
  Top 0.254: U1.28 200.94,23.5 R4.P$1 197.2,24.3 195.7,22.8 195.7,18.2 195.4,17.9 CNR6.4
T3-A
  Top 0.254: U1.29 210.4,23 209.4,22 200.84,22 R3.P$1 200,22.7 196.2,18.9 196.2,16.4 195.7,15.9 CNR6.3
T4-A
  Top 0.254: U1.32 217.9,21.5 217.4,22 215.4,22 214.9,22.5 210.7,22.5 208.8,20.6 200.84,20.6 R2.P$1 199.3,21.3 196.7,18.7 196.7,14.3 196.3,13.9 CNR6.2
T5-A
  Top 0.254: U1.33 217.8,21 217.2,21.6 214.7,21.6 214.3,22 211,22 208,19 201.04,19 R1.P$1 198.6,19.9 197.3,18.6 197.3,13 196.2,11.9 CNR6.1
WDT-A
  Top 0.254: R16.P$1 214.7,17.24 214.7,17.8 214.92,18.02 218.58,18.02 U1.39

### Text on the board
tPlace: 1 | 9 | NC | 1 | 9 | NC | 3 | 5 | 7 | 3 | 5 | 7 | 7 | 12 | 1 | 6 | 0 | 2 | 4 | 6 | 8 | 10 | 0 | 2 | 4 | 6 | 8 | 10 | www.teamojas.com | v10.0 | Board No. | IM | M-SIDE | IM | IP | S-SIDE | IP | #RR | C:/Users/user pc/Downloads/TE_new_logo.bmp
bPlace: 0 | 2 | 4 | WARNING / HIGH VOLTAGE | www.teamojas.com